# EAGLE design shifter_test (EAGLE 5.10)
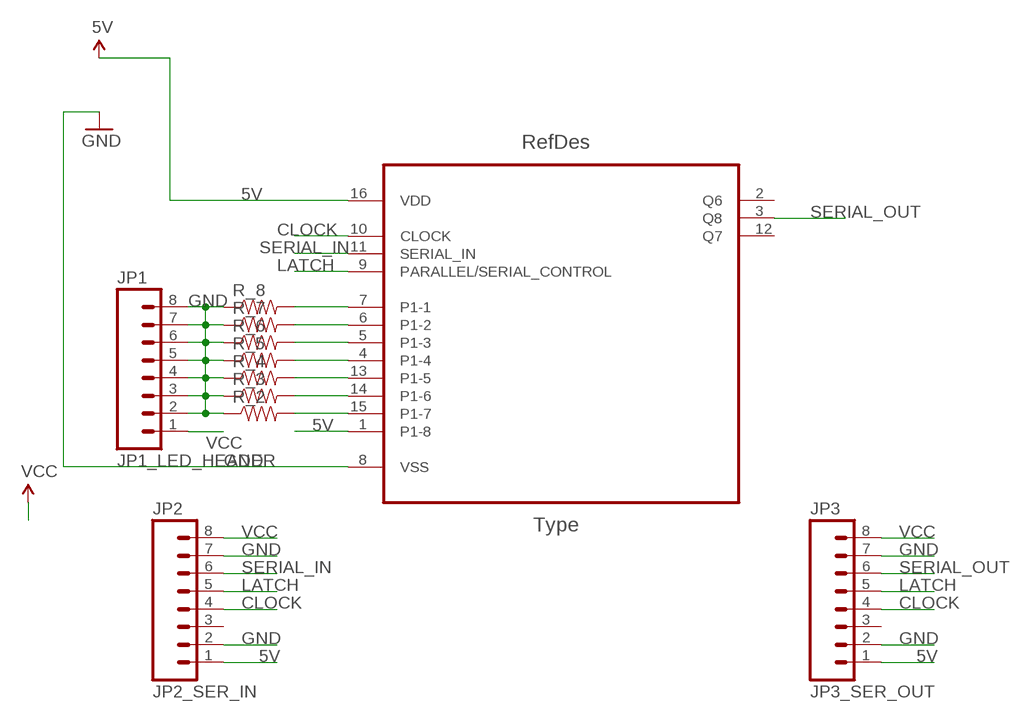
[diagram p0: schematic, sheet 1]

## Parts
JP1  JP1_LED_HEADER  M081X08  [1X08]
JP2  JP2_SER_IN  M081X08  [1X08]
JP3  JP3_SER_OUT  M081X08  [1X08]
R_2  RESISTORAXIAL-0.3  [AXIAL-0.3]
R_3  RESISTORAXIAL-0.3  [AXIAL-0.3]
R_4  RESISTORAXIAL-0.3  [AXIAL-0.3]
R_5  RESISTORAXIAL-0.3  [AXIAL-0.3]
R_6  RESISTORAXIAL-0.3  [AXIAL-0.3]
R_7  RESISTORAXIAL-0.3  [AXIAL-0.3]
R_8  RESISTORAXIAL-0.3  [AXIAL-0.3]
U1  CD4021BE  [DIP254P762X508-16]

## Nets
5V: JP2.1 JP3.1 U1.1(P1-8) U1.16(VDD)
CLOCK: JP2.4 JP3.4 U1.10(CLOCK)
GND: JP1.2 JP1.3 JP1.4 JP1.5 JP1.6 JP1.7 JP1.8 JP2.2 JP2.7 JP3.2 JP3.7 R_2.P$1 R_3.P$1 R_4.P$1 R_5.P$1 R_6.P$1 R_7.P$1 R_8.P$1 U1.8(VSS)
LATCH: JP2.5 JP3.5 U1.9(PARALLEL/SERIAL_CONTROL)
N$3: R_8.P$2 U1.7(P1-1)
N$4: R_7.P$2 U1.6(P1-2)
N$5: R_6.P$2 U1.5(P1-3)
N$6: R_5.P$2 U1.4(P1-4)
N$7: R_4.P$2 U1.13(P1-5)
N$8: R_3.P$2 U1.14(P1-6)
N$9: R_2.P$2 U1.15(P1-7)
SERIAL_IN: JP2.6 U1.11(SERIAL_IN)
SERIAL_OUT: JP3.6 U1.3(Q8)
VCC: JP1.1 JP2.8 JP3.8
Unconnected: JP2.3 JP3.3 U1.2(Q6) U1.12(Q7)

## Library data of the parts
JP1-JP3 = SparkFun:M08: Header 8 Standard 8-pin 0.1" header. Use with straight break away headers (SKU : PRT-00116), right angle break away headers (PRT-00553), swiss pins (PRT-00743), machine pins (PRT-00117), and female headers (PRT-00115).
R_2-R_8 = SparkFun:RESISTOR: Resistor Basic schematic elements and footprints for 0603, 1206, and PTH resistors.
U1 = cd4021be:CD4021BE: CMOS 8-STAGE SHIFT REGISTERS; DESCRIPTION: CMOS 8-STAGE SHIFT REGISTERS; MPN: CD4021BE; OC_FARNELL: -; OC_NEWARK: 60K5104; PACKAGE: PDIP-16; SUPPLIER: Texas Instruments

## Board
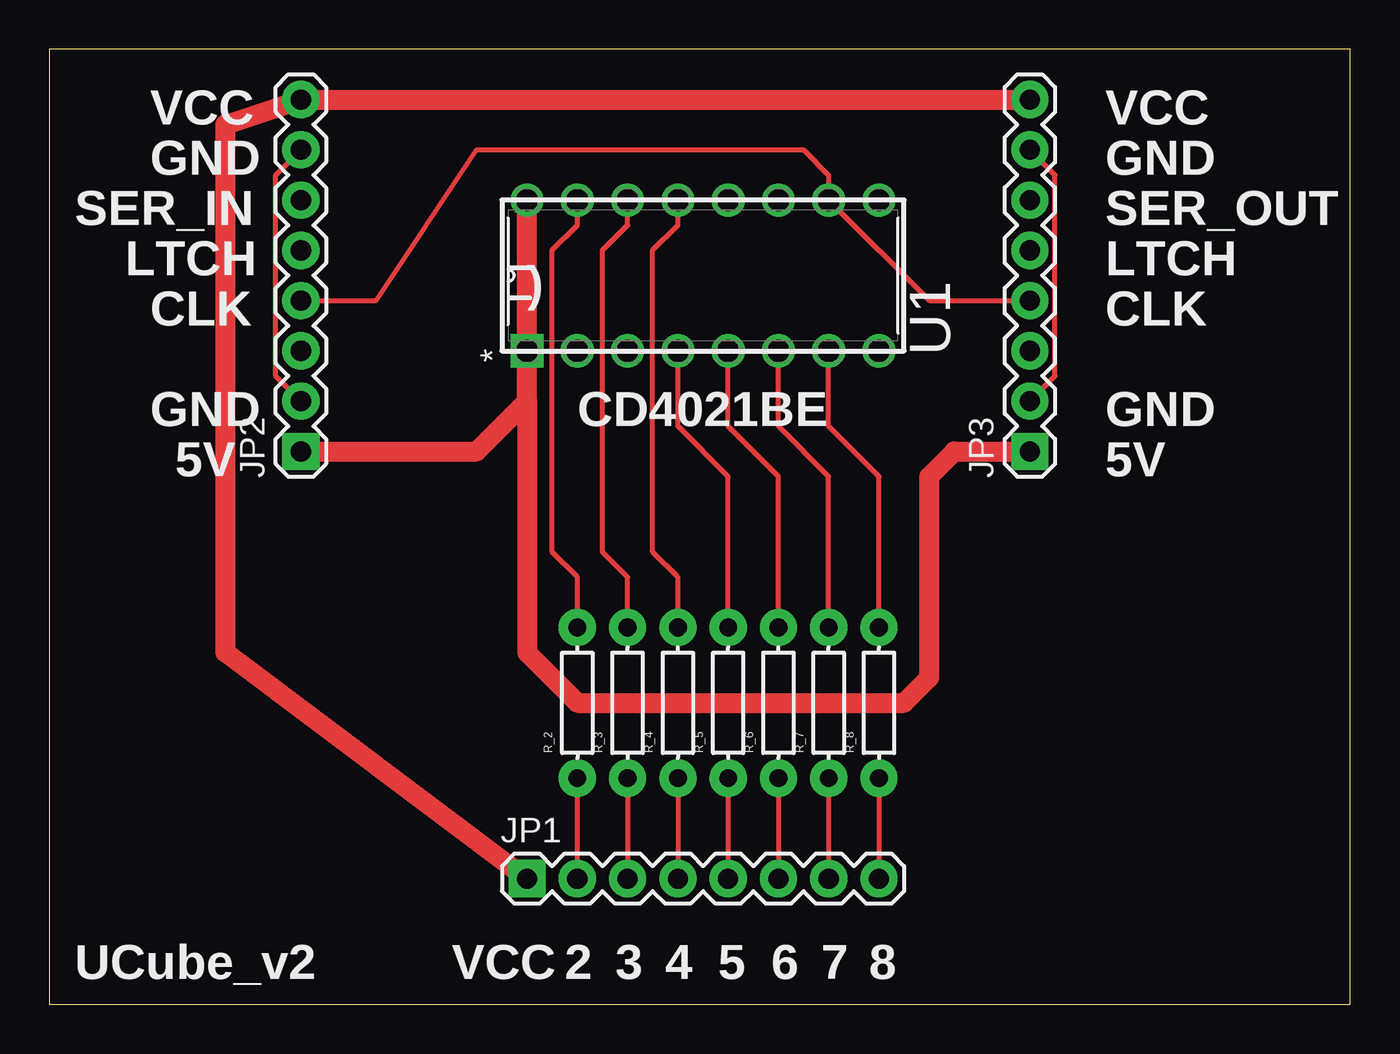
[diagram p1: board, top side]
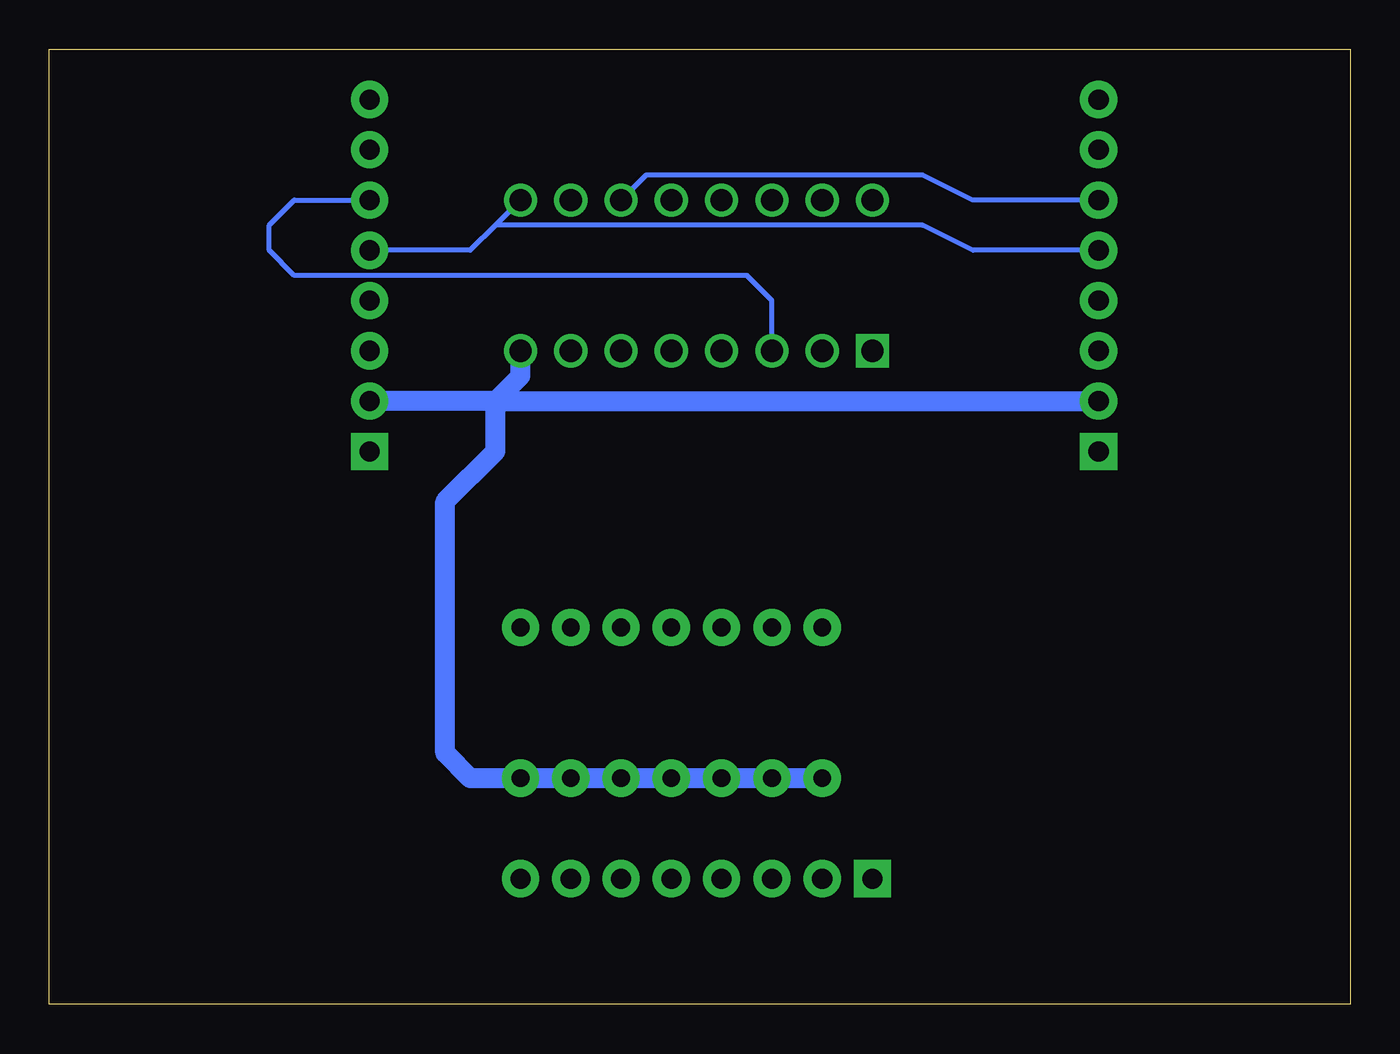
[diagram p2: board, bottom side, seen from below]

Size 65.71 x 48.25 mm. Coordinates in mm from the lower left corner, seen from the top.
Outline: 0,0 65.71,0 65.71,48.25 0,48.25 0,0
Copper layers (1*16): Top 0.035mm / dielectric 1.5mm / Bottom 0.035mm
Design rules "default": minimum track width 10mil, minimum drill 24mil, track to track 8mil, track to pad 8mil, pad to pad 8mil, via to via 8mil, smd to smd 8mil, copper to edge 40mil, drill to drill 8mil, minimum pad ring 10mil, minimum via ring 8mil, stop-mask expansion 4mil, vias tented up to drill 0mil, thermal gap 10mil

### Footprints (pad centres in the part's own frame; a part is rotated, then mirrored left to right if it is on the bottom)
1X08 = drill 1.016 pad 1.88 square: 1 0,0 | drill 1.016 pad 1.88 round: 2 2.54,0; 3 5.08,0; 4 7.62,0; 5 10.16,0; 6 12.7,0; 7 15.24,0; 8 17.78,0
AXIAL-0.3 = drill 0.9 pad 1.88 round: P$1 -3.81,0; P$2 3.81,0
DIP254P762X508-16 = drill 1.118 square: 1 -7.62,17.78 | drill 1.118 round: 2 -7.62,15.24; 3 -7.62,12.7; 4 -7.62,10.16; 5 -7.62,7.62; 6 -7.62,5.08; 7 -7.62,2.54; 8 -7.62,0; 9 0,0; 10 0,2.54; 11 0,5.08; 12 0,7.62; 13 0,10.16; 14 0,12.7; 15 0,15.24; 16 0,17.78

### Placement (x,y rotation side)
JP1  24.13,6.35 0 top
JP2  12.7,27.94 90 top
JP3  49.53,27.94 90 top
R_2  26.67,15.24 90 top
R_3  29.21,15.24 90 top
R_4  31.75,15.24 90 top
R_5  34.29,15.24 90 top
R_6  36.83,15.24 90 top
R_7  39.37,15.24 90 top
R_8  41.91,15.24 90 top
U1  41.91,40.64 90 top

### Tracks (layer width: path | path; a pad name or v marks a point on that pad's centre or on a via)
5V
  Top 1.016: U1.16 U1.1 24.13,30.48 | 24.13,30.48 24.13,17.78 26.67,15.24 43.18,15.24 44.45,16.51 44.45,26.67 45.72,27.94 JP3.1 | JP2.1 21.59,27.94 24.13,30.48
CLOCK
  Top 0.254: JP3.4 44.45,35.56 U1.10 39.37,41.91 38.1,43.18 21.59,43.18 16.51,35.56 JP2.4
GND
  Top 0.254: R_3.P$1 JP1.3 | R_4.P$1 JP1.4 | R_5.P$1 JP1.5 | R_6.P$1 JP1.6 | R_7.P$1 JP1.7 | R_8.P$1 JP1.8 | JP1.2 R_2.P$1 | JP2.7 11.43,41.91 11.43,31.75 JP2.2 | JP3.7 50.8,41.91 50.8,31.75 JP3.2
  Bottom 1.016: 43.18,30.48 JP3.2 | 43.18,30.48 41.91,31.75 U1.8 | 43.18,30.48 JP2.2 | R_2.P$1 R_3.P$1 R_4.P$1 R_5.P$1 R_6.P$1 R_7.P$1 R_8.P$1 44.45,11.43 45.72,12.7 45.72,25.4 43.18,27.94 43.18,30.48
LATCH
  Bottom 0.254: 43.18,39.37 U1.9 | 43.18,39.37 44.45,38.1 JP3.5 | 43.18,39.37 21.59,39.37 19.05,38.1 JP2.5
N$3
  Top 0.254: R_8.P$2 41.91,26.67 39.37,29.21 U1.7
N$4
  Top 0.254: U1.6 36.83,29.21 39.37,26.67 R_7.P$2
N$5
  Top 0.254: R_6.P$2 36.83,26.67 34.29,29.21 U1.5
N$6
  Top 0.254: R_5.P$2 34.29,26.67 31.75,29.21 U1.4
N$7
  Top 0.254: R_4.P$2 31.75,21.59 30.48,22.86 30.48,38.1 31.75,39.37 U1.13
N$8
  Top 0.254: R_3.P$2 29.21,21.59 27.94,22.86 27.94,38.1 29.21,39.37 U1.14
N$9
  Top 0.254: R_2.P$2 26.67,21.59 25.4,22.86 25.4,38.1 26.67,39.37 U1.15
SERIAL_IN
  Bottom 0.254: U1.11 35.56,41.91 21.59,41.91 19.05,40.64 JP2.6
SERIAL_OUT
  Bottom 0.254: U1.3 29.21,35.56 30.48,36.83 53.34,36.83 54.61,38.1 54.61,39.37 53.34,40.64 JP3.6
VCC
  Top 1.016: JP1.1 8.89,17.78 8.89,44.45 JP2.8 JP3.8

### Text on the board
tPlace: VCC | VCC | GND | GND | SER_IN | SER_OUT | LTCH | LTCH | ) | CLK | CLK | GND | CD4021BE | GND | 5V | 5V | UCube_v2 | VCC | 2 | 3 | 4 | 5 | 6 | 7 | 8